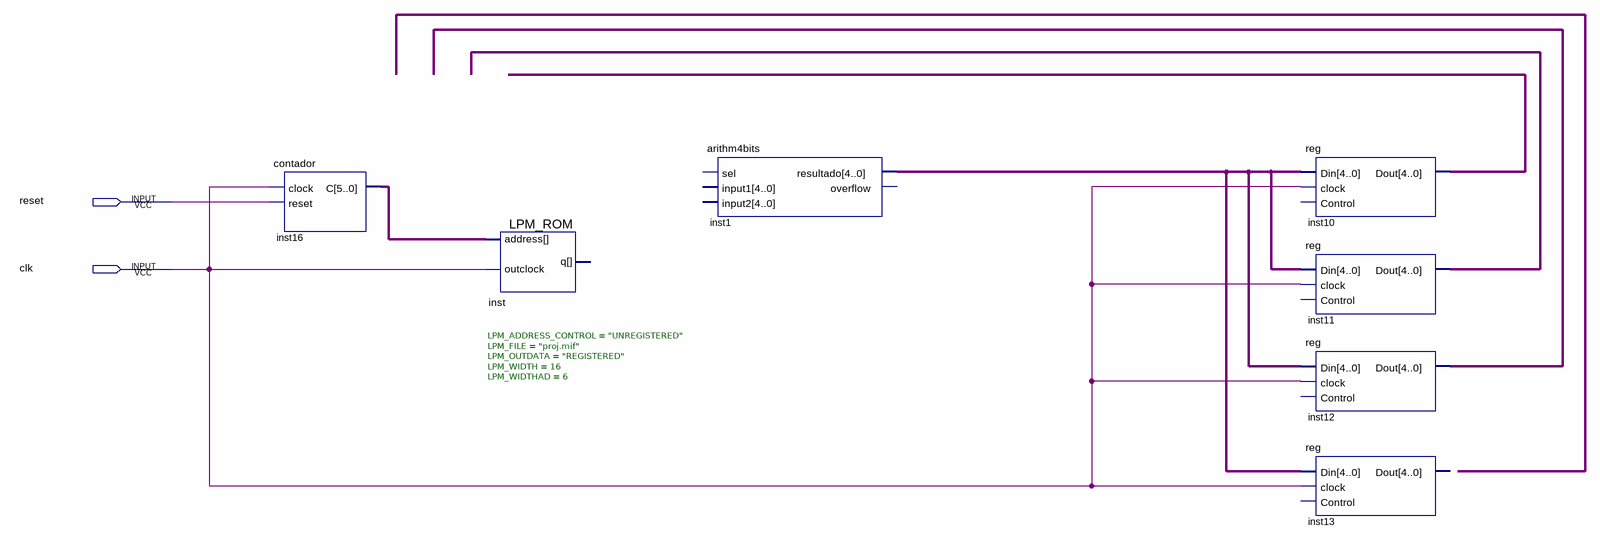
[diagram p0: schematic sheet]
// Quartus schematic proj.bdf as structural Verilog: 7 symbols, 2 pins
module proj (
  input  reset,
  input  clk
);

  wire [4:0] inst1_resultado, inst10_dout, inst11_dout, inst12_dout;
  wire [5:0] inst16_c;

  contador inst16 (.clock(clk), .reset(reset), .C(inst16_c));
  LPM_ROM #(.LPM_ADDRESS_CONTROL("UNREGISTERED"), .LPM_FILE("proj.mif"), .LPM_OUTDATA("REGISTERED"), .LPM_WIDTH(16), .LPM_WIDTHAD(6)) inst (
    .address(inst16_c), .outclock(clk));  // open: q
  arithm4bits inst1 (.resultado(inst1_resultado));  // open: sel, input1, input2, overflow
  \reg  inst10 (.Din(inst1_resultado), .clock(clk), .Dout(inst10_dout));  // open: Control
  \reg  inst11 (.Din(inst1_resultado), .clock(clk), .Dout(inst11_dout));  // open: Control
  \reg  inst12 (.Din(inst1_resultado), .clock(clk), .Dout(inst12_dout));  // open: Control
  \reg  inst13 (.Din(inst1_resultado), .clock(clk));  // open: Control, Dout
endmodule
